# EAGLE design RELAISKARTE (EAGLE 4.16)
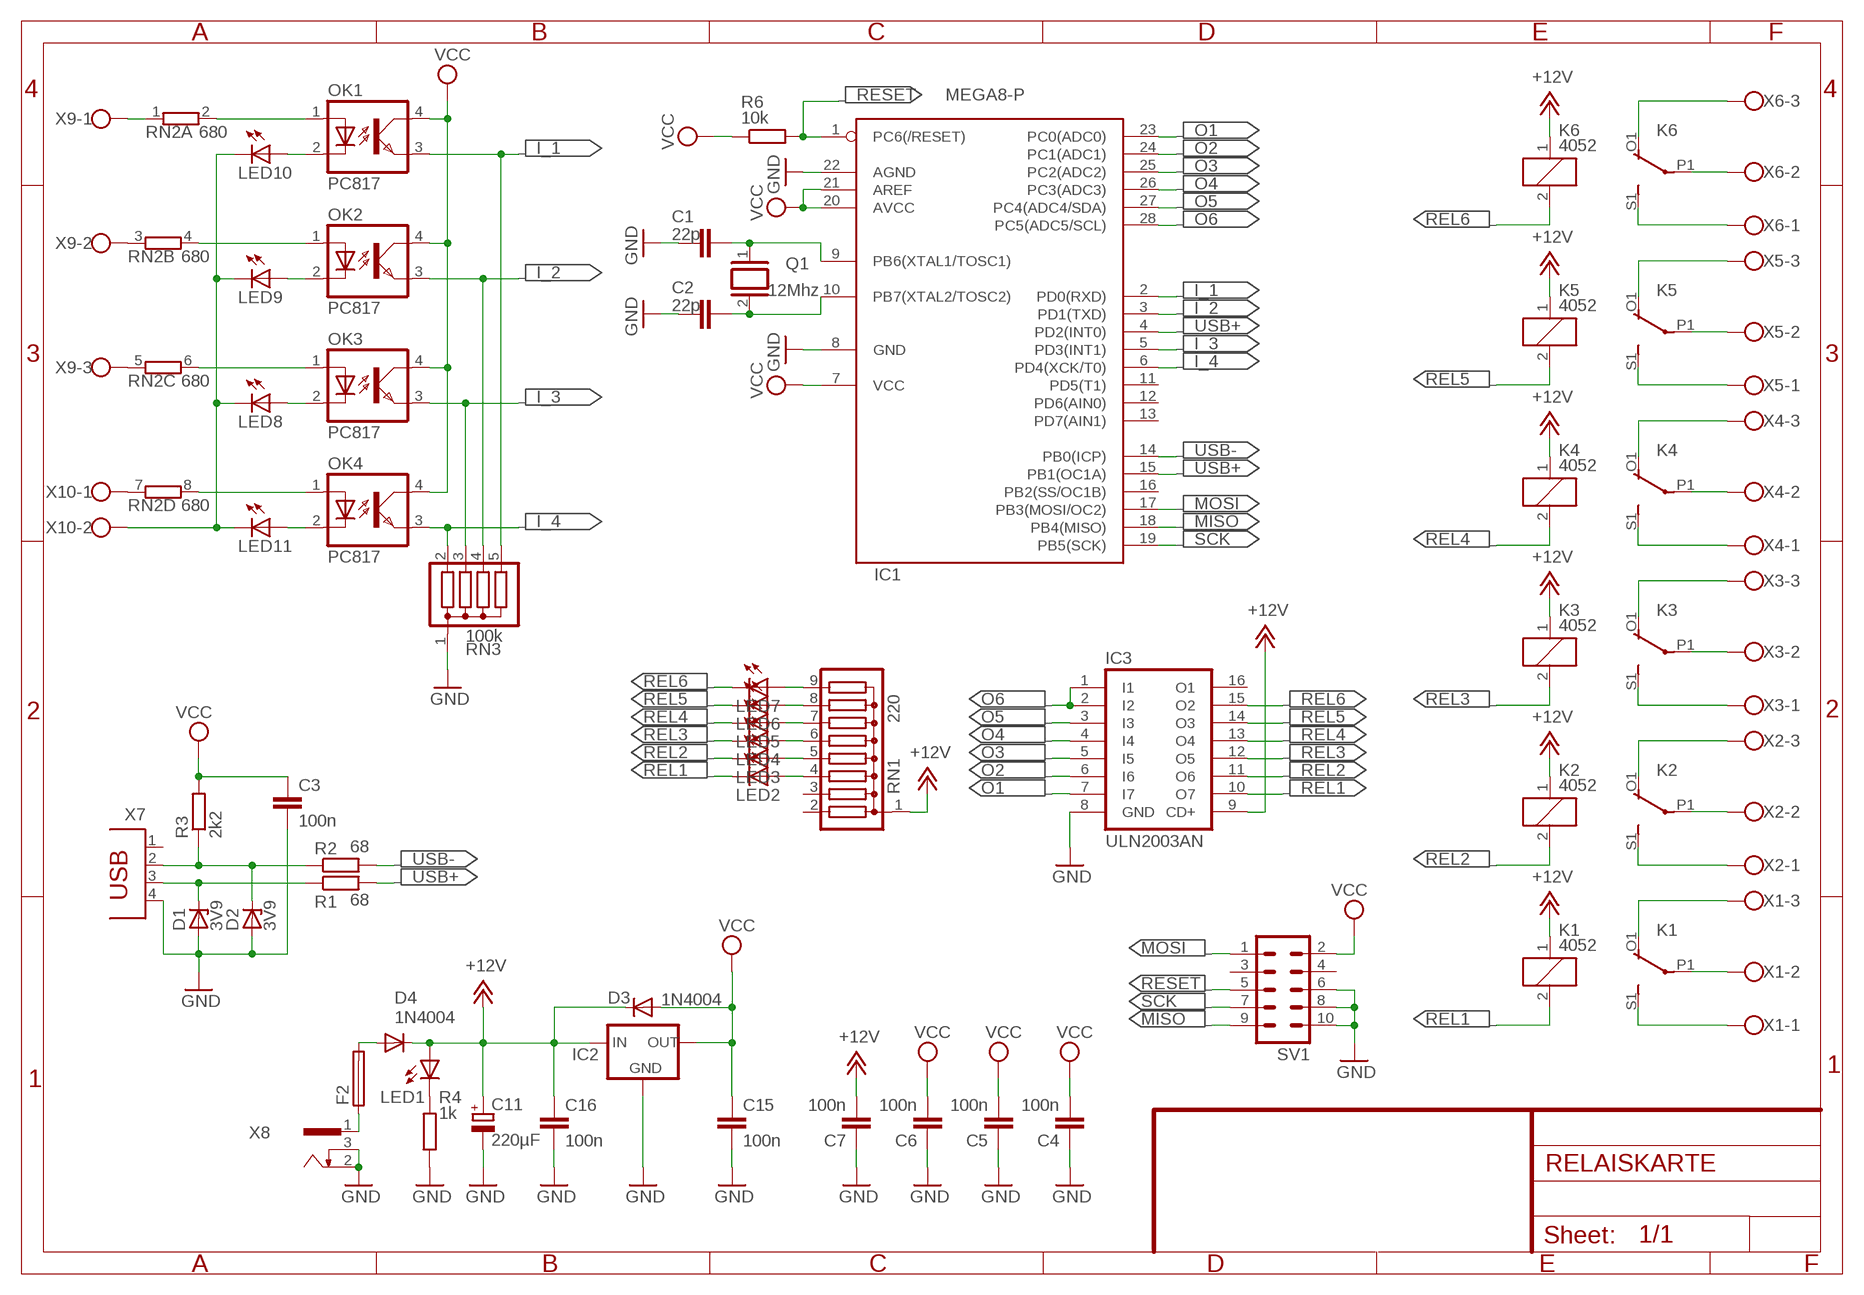
[diagram p0: schematic, sheet 1]

## Parts
C1  22p  C-EU025-024X044  [C025-024X044]
C2  22p  C-EU025-024X044  [C025-024X044]
C3  100n  C-EU050-024X044  [C050-024X044]
C4  100n  C-EU025-024X044  [C025-024X044]
C5  100n  C-EU025-024X044  [C025-024X044]
C6  100n  C-EU025-024X044  [C025-024X044]
C7  100n  C-EU025-024X044  [C025-024X044]
C11  220µF  CPOL-EUE3.5-8  [E3,5-8]
C15  100n  C-EU050-024X044  [C050-024X044]
C16  100n  C-EU050-024X044  [C050-024X044]
D1  3V9  BZX55  [DO35Z10]
D2  3V9  BZX55  [DO35Z10]
D3  1N4004  [DO41-10]
D4  1N4004  [DO41-10]
F2  PICOFUSE  [PICOFUSE]
IC1  MEGA8-P  [DIL28-3]
IC2  78XXS  [78XXS]
IC3  ULN2003AN  [DIL16]
K1  4052  [F4052]
K2  4052  [F4052]
K3  4052  [F4052]
K4  4052  [F4052]
K5  4052  [F4052]
K6  4052  [F4052]
LED1  LEDSQR2X5  [LED2X5]
LED2  LEDSQR2X5  [LED2X5]
LED3  LEDSQR2X5  [LED2X5]
LED4  LEDSQR2X5  [LED2X5]
LED5  LEDSQR2X5  [LED2X5]
LED6  LEDSQR2X5  [LED2X5]
LED7  LEDSQR2X5  [LED2X5]
LED8  LEDSQR2X5  [LED2X5]
LED9  LEDSQR2X5  [LED2X5]
LED10  LEDSQR2X5  [LED2X5]
LED11  LEDSQR2X5  [LED2X5]
OK1  PC817  [DIL04]
OK2  PC817  [DIL04]
OK3  PC817  [DIL04]
OK4  PC817  [DIL04]
Q1  12Mhz  XTAL/S  [QS]
R1  68  R-EU_0207/10  [0207/10]
R2  68  R-EU_0207/10  [0207/10]
R3  2k2  R-EU_0207/10  [0207/10]
R4  1k  R-EU_0207/10  [0207/10]
R6  10k  R-EU_0207/10  [0207/10]
RN1  220  G08R  [SIL9]
RN2  680  E4R  [SIL8]
RN3  100k  G04R  [SIL5]
SV1  ML10  [ML10]
X1  W237-103  [W237-103]
X2  W237-103  [W237-103]
X3  W237-103  [W237-103]
X4  W237-103  [W237-103]
X5  W237-103  [W237-103]
X6  W237-103  [W237-103]
X7  PN61729  [PN61729]
X8  SCD-014A  [SCD-014-A]
X9  W237-3E  [W237-3E]
X10  W237-02P  [W237-132]

## Nets
+12V: C7.2 C11.+ C16.1 D3.C D4.C IC2.IN IC3.9(CD+) K1.1 K2.1 K3.1 K4.1 K5.1 K6.1 LED1.A RN1.1
GND: C1.1 C2.1 C3.2 C4.1 C5.1 C6.1 C7.1 C11.- C15.2 C16.2 D1.A D2.A IC1.8(GND) IC1.22(AGND) IC2.GND IC3.8(GND) R4.1 RN3.1 SV1.6 SV1.8 SV1.10 X7.4 X8.2 X8.3
I_1: IC1.2(PD0(RXD)) OK1.3(EMIT) RN3.5
I_2: IC1.3(PD1(TXD)) OK2.3(EMIT) RN3.4
I_3: IC1.5(PD3(INT1)) OK3.3(EMIT) RN3.3
I_4: IC1.6(PD4(XCK/T0)) OK4.3(EMIT) RN3.2
MISO: IC1.18(PB4(MISO)) SV1.9
MOSI: IC1.17(PB3(MOSI/OC2)) SV1.1
N$1: C1.2 IC1.9(PB6(XTAL1/TOSC1)) Q1.1
N$2: K5.P1(2:P) X5.2
N$3: K6.P1(2:P) X6.2
N$4: C2.2 IC1.10(PB7(XTAL2/TOSC2)) Q1.2
N$5: D1.C R1.1 X7.3
N$6: D2.C R2.1 R3.1 X7.2
N$7: LED7.A RN1.9
N$8: LED1.K(C) R4.2
N$9: K1.S1(2:S) X1.1
N$10: K1.O1(2:O) X1.3
N$11: K2.S1(2:S) X2.1
N$12: K2.O1(2:O) X2.3
N$13: K3.S1(2:S) X3.1
N$14: K3.O1(2:O) X3.3
N$15: K4.S1(2:S) X4.1
N$16: K4.O1(2:O) X4.3
N$17: K5.S1(2:S) X5.1
N$18: K5.O1(2:O) X5.3
N$19: K6.S1(2:S) X6.1
N$20: K6.O1(2:O) X6.3
N$21: D4.A F2.2
N$22: F2.1 X8.1
N$25: K1.P1(2:P) X1.2
N$27: K2.P1(2:P) X2.2
N$28: K3.P1(2:P) X3.2
N$29: K4.P1(2:P) X4.2
N$31: OK1.1(A) RN2.2
N$32: OK2.1(A) RN2.4
N$34: LED6.A RN1.8
N$35: LED5.A RN1.7
N$36: LED4.A RN1.6
N$37: LED3.A RN1.5
N$38: LED2.A RN1.4
N$39: OK3.1(A) RN2.6
N$40: OK4.1(A) RN2.8
N$41: RN2.1 X9.1
N$42: RN2.3 X9.2
N$43: RN2.5 X9.3
N$44: RN2.7 X10.1
N$45: LED8.K(C) LED9.K(C) LED10.K(C) LED11.K(C) X10.2
N$46: LED10.A OK1.2(C)
N$47: LED9.A OK2.2(C)
N$48: LED8.A OK3.2(C)
N$49: LED11.A OK4.2(C)
O1: IC1.23(PC0(ADC0)) IC3.7(I7)
O2: IC1.24(PC1(ADC1)) IC3.6(I6)
O3: IC1.25(PC2(ADC2)) IC3.5(I5)
O4: IC1.26(PC3(ADC3)) IC3.4(I4)
O5: IC1.27(PC4(ADC4/SDA)) IC3.3(I3)
O6: IC1.28(PC5(ADC5/SCL)) IC3.1(I1) IC3.2(I2)
REL1: IC3.10(O7) K1.2 LED2.K(C)
REL2: IC3.11(O6) K2.2 LED3.K(C)
REL3: IC3.12(O5) K3.2 LED4.K(C)
REL4: IC3.13(O4) K4.2 LED5.K(C)
REL5: IC3.14(O3) K5.2 LED6.K(C)
REL6: IC3.15(O2) K6.2 LED7.K(C)
RESET: IC1.1(PC6(/RESET)) R6.2 SV1.5
SCK: IC1.19(PB5(SCK)) SV1.7
USB+: IC1.4(PD2(INT0)) IC1.15(PB1(OC1A)) R1.2
USB-: IC1.14(PB0(ICP)) R2.2
VCC: C3.1 C4.2 C5.2 C6.2 C15.1 D3.A IC1.7(VCC) IC1.20(AVCC) IC1.21(AREF) IC2.OUT OK1.4(COL) OK2.4(COL) OK3.4(COL) OK4.4(COL) R3.2 R6.1 SV1.2
Unconnected: IC1.11(PD5(T1)) IC1.12(PD6(AIN0)) IC1.13(PD7(AIN1)) IC1.16(PB2(SS/OC1B)) IC3.16(O1) K1.O2(3:O) K1.P2(3:P) K1.S2(3:S) K2.O2(3:O) K2.P2(3:P) K2.S2(3:S) K3.O2(3:O) K3.P2(3:P) K3.S2(3:S) K4.O2(3:O) K4.P2(3:P) K4.S2(3:S) K5.O2(3:O) K5.P2(3:P) K5.S2(3:S) K6.O2(3:O) K6.P2(3:P) K6.S2(3:S) RN1.2 RN1.3 SV1.3 SV1.4 X7.1

## Library data of the parts
C1-C7 C15 C16 = rcl:C-EU: CAPACITOR, European symbol
C11 = rcl:CPOL-EU: POLARIZED CAPACITOR, European symbol
D1 D2 = diode:BZX55: Z DIODE
D3 D4 = diode:1N4004: DIODE general purpose rectifier, 1 A
F2 = fuse:PICOFUSE: PICOFUSE 19275, Wickmann
IC1 = avr-1:MEGA8-P: MICROCONTROLLER 8 Kbytes FLASH 1 kbytes SRAM 512 bytes EEPROM USART 4-channel 10 bit ADC 2-channel 8 bit ADC
IC2 = v-reg:78XXS: VOLTAGE REGULATOR
IC3 = uln-udn:ULN2003A: DRIVER ARRAY
K1-K6 = relay:4052: RELAY 2 x switch, Finder
LED1-LED11 = led:LED: LED OSRAM: - CHIPLED LG R971, LG N971, LY N971, LG Q971, LY Q971, LO R971, LY R971 LH N974, LH R974 LS Q976, LO Q976, LY Q976 LO Q996 - Hyper CHIPLED LW Q18S LB Q993, LB Q99A, LB R99A - SideLED LS A670, LO A670, LY A670, LG A670, LP A670 LB A673, LV A673, LT A673, LW A673 LH A674 LY A675 LS A676, LA A676, LO A676, LY A676, LW A676 LS A679, LY A679, LG A679 - Hyper Micro SIDELED® LS Y876, LA Y876, LO Y876, LY Y876 LT Y87S - SmartLED LW L88C, LW L88S LB L89C, LB L89S, LG L890 LS L89K, LO L89K, LY L89K LS L896, LA L896, LO L896, LY L896 - TOPLED LS T670, LO T670, LY T670, LG T670, LP T670 LSG T670, LSP T670, LSY T670, LOP T670, LYG T670 LG T671, LOG T671, LSG T671 LB T673, LV T673, LT T673, LW T673 LH T674 LS T676, LA T676, LO T676, LY T676, LB T676, LH T676, LSB T676, LW T676 LB T67C, LV T67C, LT T67C, LS T67K, LO T67K, LY T67K, LW E67C LS E67B, LA E67B, LO E67B, LY E67B, LB E67C, LV E67C, LT E67C LW T67C LS T679, LY T679, LG T679 LS T770, LO T770, LY T770, LG T770, LP T770 LB T773, LV T773, LT T773, LW T773 LH T774 LS E675, LA E675, LY E675, LS T675 LS T776, LA T776, LO T776, LY T776, LB T776 LHGB T686 LT T68C, LB T68C - Hyper Mini TOPLED® LB M676 - Mini TOPLED Santana® LG M470 LS M47K, LO M47K, LY M47K Source: http://www.osram.convergy.de - LUMILED® LXK2-PW12-R00, LXK2-PW12-S00, LXK2-PW14-U00, LXK2-PW14-V00 LXK2-PM12-R00, LXK2-PM12-S00, LXK2-PM14-U00 LXK2-PE12-Q00, LXK2-PE12-R00, LXK2-PE12-S00, LXK2-PE14-T00, LXK2-PE14-U00 LXK2-PB12-K00, LXK2-PB12-L00, LXK2-PB12-M00, LXK2-PB14-N00, LXK2-PB14-P00, LXK2-PB14-Q00 LXK2-PR12-L00, LXK2-PR12-M00, LXK2-PR14-Q00, LXK2-PR14-R00 LXK2-PD12-Q00, LXK2-PD12-R00, LXK2-PD12-S00 LXK2-PH12-R00, LXK2-PH12-S00 LXK2-PL12-P00, LXK2-PL12-Q00, LXK2-PL12-R00 Source: www.luxeon.com
OK1-OK4 = optocoupler:PC817: SHARP OPTO COUPLER
Q1 = special:XTAL/S: CRYSTAL
R1-R4 R6 = rcl:R-EU_: RESISTOR, European symbol
RN1 = resistor-sil:G08R: SIL RESISTOR
RN2 = resistor-sil:E4R: SIL RESISTOR
RN3 = resistor-sil:G04R: SIL RESISTOR
SV1 = con-harting-ml:ML10: HARTING
X1-X6 = con-wago-500:W237-103: WAGO SCREW CLAMP
X7 = con-berg:PN61729: BERG USB connector
X8 = con-shiua-chyuan:SCD-014A: Power Jack 2.5mm
X9 = con-wago-508:W237-3E: WAGO SREW CLAMP
X10 = con-wago-508:W237-02P: WAGO SREW CLAMP

## Board
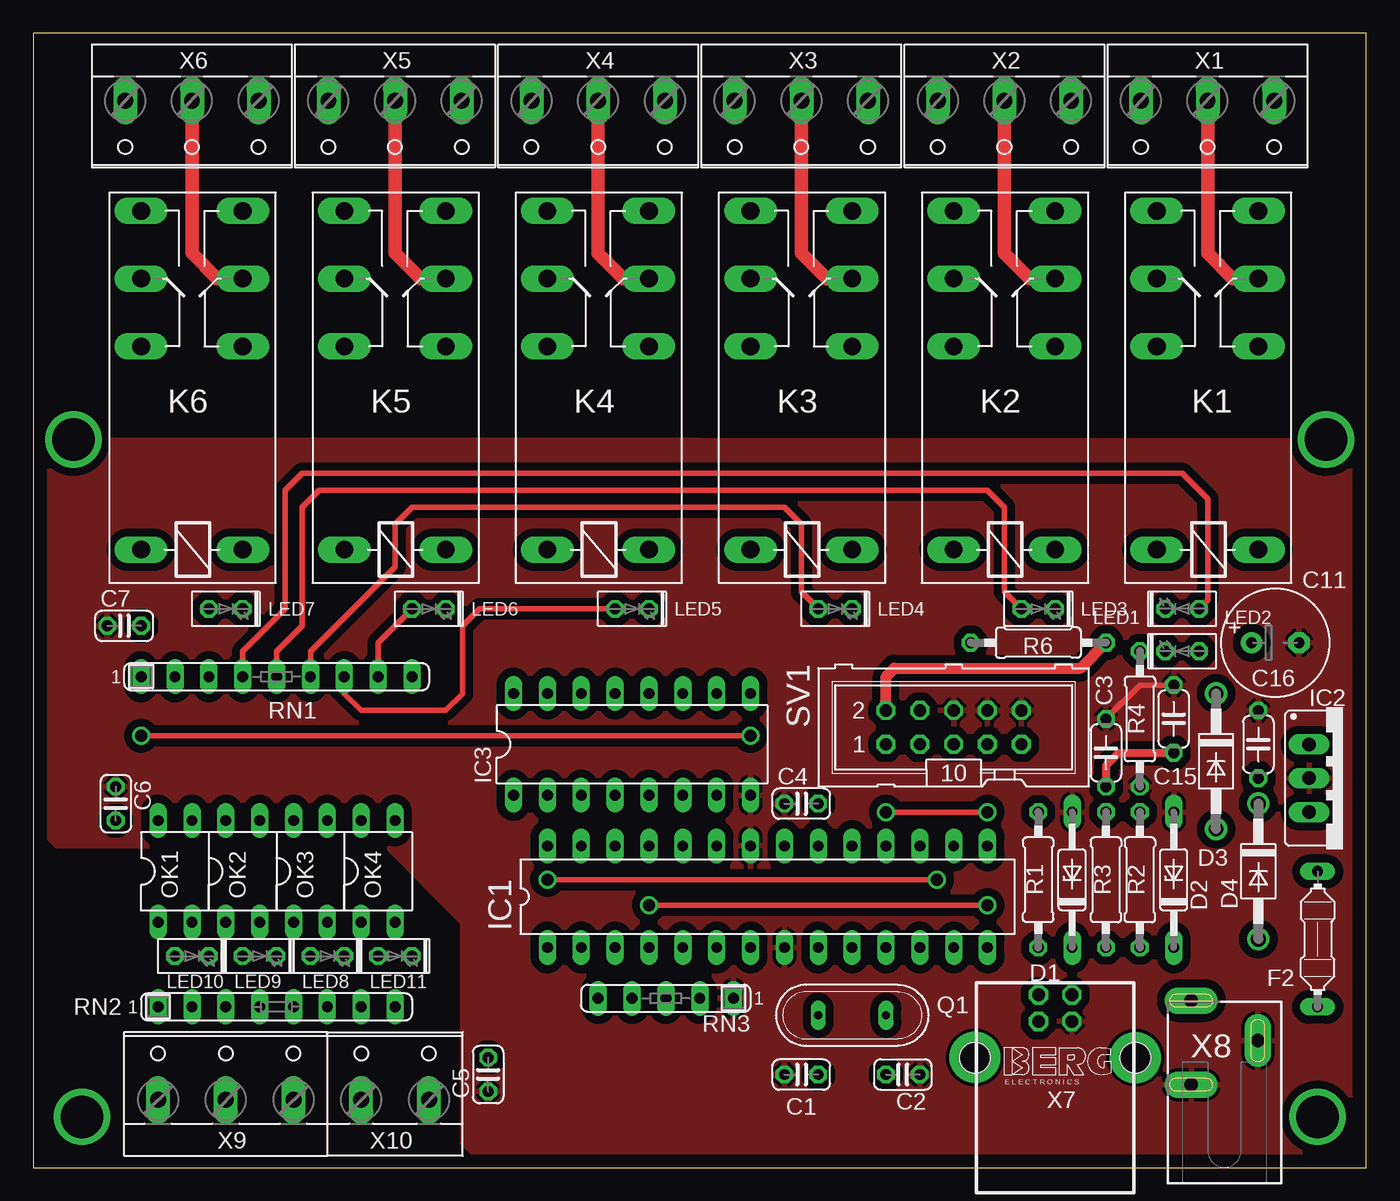
[diagram p1: board, top side]
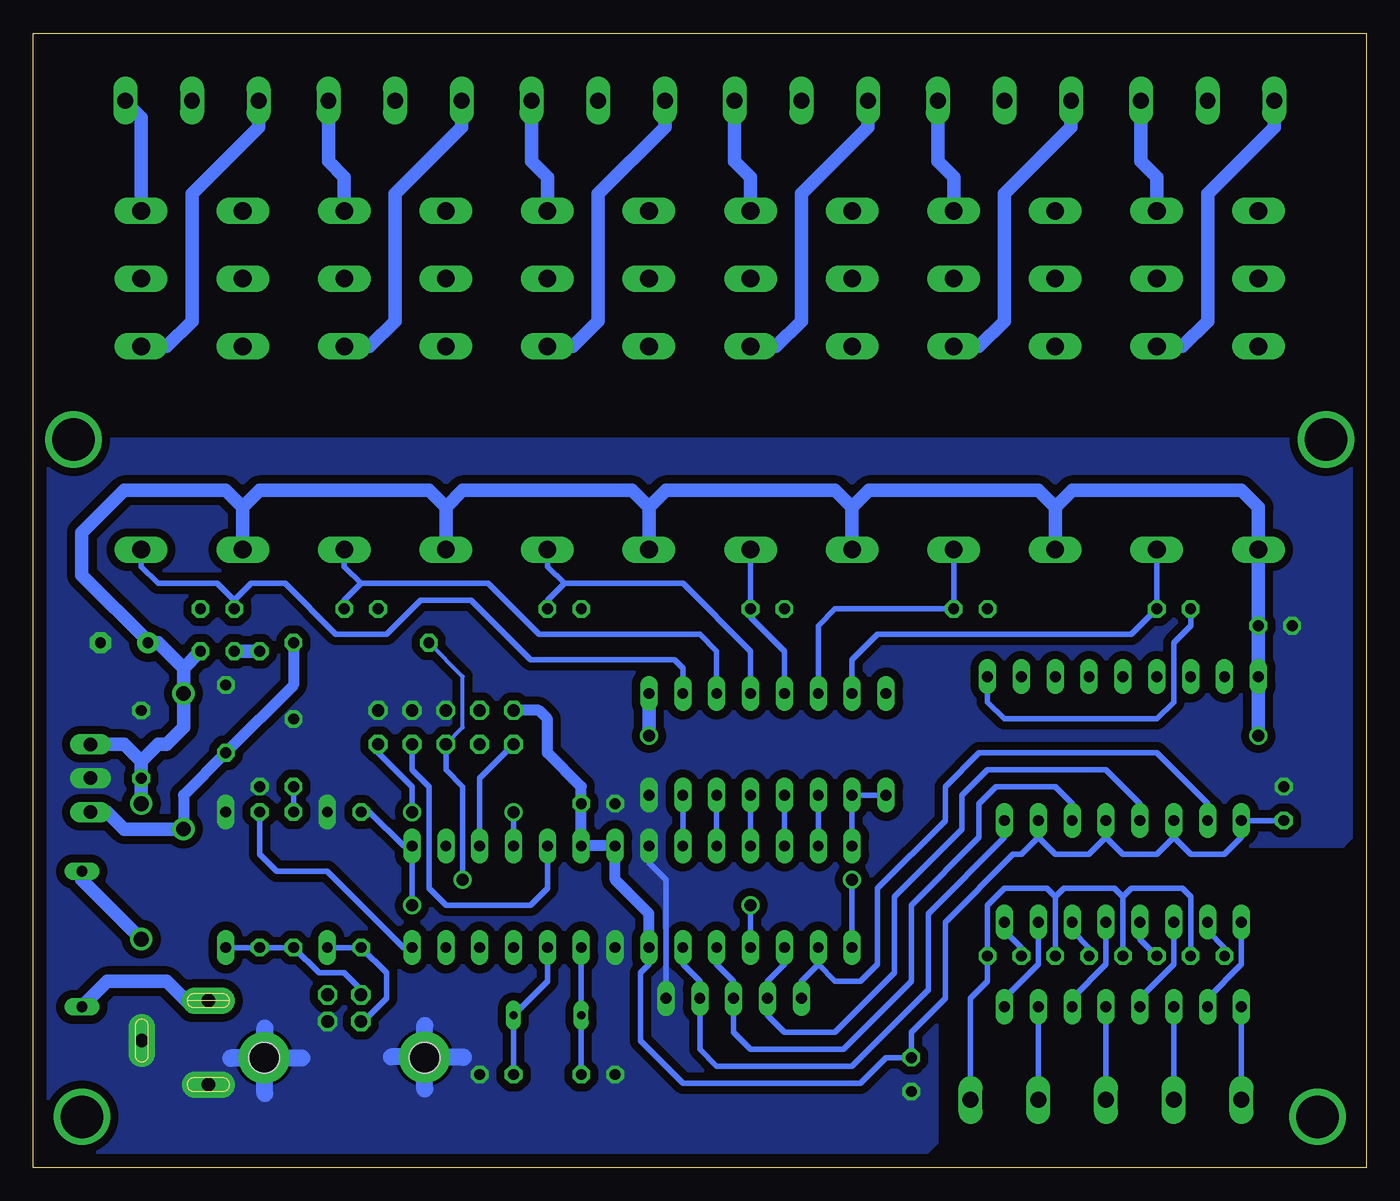
[diagram p2: board, bottom side, seen from below]

Size 100 x 85.07 mm. Coordinates in mm from the lower left corner, seen from the top.
Outline: 100,0 100,85.07 0,85.07 0,0 100,0
Copper layers (1*16): Top 0.035mm / dielectric 1.5mm / Bottom 0.035mm
Design rules "default": minimum track width 10mil, minimum drill 24mil, track to track 8mil, track to pad 8mil, pad to pad 8mil, via to via 8mil, smd to smd 8mil, copper to edge 40mil, drill to drill 8mil, minimum pad ring 10mil, minimum via ring 8mil, stop-mask expansion 4mil, vias tented up to drill 0mil, thermal gap 10mil

### Footprints (pad centres in the part's own frame; a part is rotated, then mirrored left to right if it is on the bottom)
C025-024X044 = drill 0.813 octagon: 1 -1.27,0; 2 1.27,0
C050-024X044 = drill 0.813 octagon: 1 -2.54,0; 2 2.54,0
E3,5-8 = drill 0.813 pad 1.6 round: + -1.778,0 | drill 0.813 pad 1.6 octagon: - 1.778,0
DO35Z10 = drill 0.813 long: A 5.08,0; C -5.08,0
DO41-10 = drill 1.118 round: A 5.08,0; C -5.08,0
PICOFUSE = drill 0.813 long: 1 -5.08,0; 2 5.08,0
DIL28-3 = drill 0.813 long: 1 -16.51,-3.81; 2 -13.97,-3.81; 3 -11.43,-3.81; 4 -8.89,-3.81; 5 -6.35,-3.81; 6 -3.81,-3.81; 7 -1.27,-3.81; 8 1.27,-3.81; 9 3.81,-3.81; 10 6.35,-3.81; 11 8.89,-3.81; 12 11.43,-3.81; 13 13.97,-3.81; 14 16.51,-3.81; 15 16.51,3.81; 16 13.97,3.81; 17 11.43,3.81; 18 8.89,3.81; 19 6.35,3.81; 20 3.81,3.81; 21 1.27,3.81; 22 -1.27,3.81; 23 -3.81,3.81; 24 -6.35,3.81; 25 -8.89,3.81; 26 -11.43,3.81; 27 -13.97,3.81; 28 -16.51,3.81
78XXS = drill 1.016 long: GND 0,-2.54; IN -2.54,-2.54; OUT 2.54,-2.54
DIL16 = drill 0.813 long: 1 -8.89,-3.81; 2 -6.35,-3.81; 3 -3.81,-3.81; 4 -1.27,-3.81; 5 1.27,-3.81; 6 3.81,-3.81; 7 6.35,-3.81; 8 8.89,-3.81; 9 8.89,3.81; 10 6.35,3.81; 11 3.81,3.81; 12 1.27,3.81; 13 -1.27,3.81; 14 -3.81,3.81; 15 -6.35,3.81; 16 -8.89,3.81
F4052 = drill 1.321 long: 1 -3.81,3.81; 2 -3.81,-3.81; O1 11.43,-3.81; O2 11.43,3.81; P1 16.51,-3.81; P2 16.51,3.81; S1 21.59,-3.81; S2 21.59,3.81
LED2X5 = drill 0.813 octagon: A -1.27,0; K 1.27,0
DIL04 = drill 0.813 long: 1 -1.27,-3.81; 2 1.27,-3.81; 3 1.27,3.81; 4 -1.27,3.81
QS = drill 0.61 long: 1 -2.54,0; 2 2.54,0
0207/10 = drill 0.813 octagon: 1 -5.08,0; 2 5.08,0
SIL9 = drill 0.813 long: 1 -10.16,0; 2 -7.62,0; 3 -5.08,0; 4 -2.54,0; 5 0,0; 6 2.54,0; 7 5.08,0; 8 7.62,0; 9 10.16,0
SIL8 = drill 0.813 long: 1 -8.89,0; 2 -6.35,0; 3 -3.81,0; 4 -1.27,0; 5 1.27,0; 6 3.81,0; 7 6.35,0; 8 8.89,0
SIL5 = drill 0.813 long: 1 -5.08,0; 2 -2.54,0; 3 0,0; 4 2.54,0; 5 5.08,0
ML10 = drill 0.914 octagon: 1 -5.08,-1.27; 2 -5.08,1.27; 3 -2.54,-1.27; 4 -2.54,1.27; 5 0,-1.27; 6 0,1.27; 7 2.54,-1.27; 8 2.54,1.27; 9 5.08,-1.27; 10 5.08,1.27
W237-103 = drill 1.194 long: 1 -5,-1.29; 2 0,-1.29; 3 5,-1.29
PN61729 = drill 0.95 octagon: 1 1.25,4.71; 2 -1.25,4.71; 3 -1.25,2.71; 4 1.25,2.71 | hole 2.3: -6.02,0; 6.02,0
SCD-014-A = drill 1 pad 2 long: 1 -2.5,13.8; 2 -2.5,7.5; 3 2.5,10.8
W237-3E = drill 1.194 long: 1 -5.08,-0.635; 2 0,-0.635; 3 5.08,-0.635
W237-132 = drill 1.194 long: 1 -2.54,-0.635; 2 2.54,-0.635

### Placement (x,y rotation side)
C1  57.62,6.98 0 top
C2  65.24,6.98 180 top
C3  80.48,31.11 90 top
C4  57.62,27.3 0 top
C5  34.12,6.98 90 top
C6  6.18,27.3 270 top
C7  6.82,40.63 0 top
C11  93.18,39.36 0 top
C15  85.56,33.65 90 top
C16  91.91,31.75 90 top
D1  77.94,21.59 90 top
D2  85.56,21.59 90 top
D3  88.73,30.48 270 top
D4  91.91,22.22 270 top
F2  96.35,17.14 90 top
IC1  55.08,20.32 0 top
IC2  98.26,29.21 270 top
IC3  44.92,31.75 0 top
K1  88.1,50.16 90 top
K2  72.86,50.16 90 top
K3  57.62,50.16 90 top
K4  42.38,50.16 90 top
K5  27.14,50.16 90 top
K6  11.9,50.16 90 top
LED1  86.19,38.73 180 top
LED2  86.19,41.9 180 top
LED3  75.4,41.9 0 top
LED4  60.16,41.9 0 top
LED5  44.92,41.9 0 top
LED6  29.68,41.9 0 top
LED7  14.44,41.9 0 top
LED8  22.06,15.87 0 top
LED9  16.98,15.87 0 top
LED10  11.9,15.87 0 top
LED11  27.14,15.87 0 top
OK1  10.63,22.22 0 top
OK2  15.71,22.22 0 top
OK3  20.79,22.22 0 top
OK4  25.87,22.22 0 top
Q1  61.43,11.42 0 top
R1  75.4,21.59 90 top
R2  83.02,21.59 90 top
R3  80.48,21.59 90 top
R4  83.02,33.65 90 top
R6  75.4,39.36 180 top
RN1  18.25,36.82 0 top
RN2  18.25,12.06 0 top
RN3  47.46,12.69 180 top
SV1  69.05,33.02 0 top
X1  88.1,78.73 180 top
X2  72.86,78.73 180 top
X3  57.62,78.73 180 top
X4  42.38,78.73 180 top
X5  27.14,78.73 180 top
X6  11.9,78.73 180 top
X7  76.67,8.25 0 top
X8  89.37,-1.27 0 top
X9  14.44,5.71 0 top
X10  27.14,5.71 0 top

### Tracks (layer width: path | path; a pad name or v marks a point on that pad's centre or on a via)
+12V  (via drill 0.9)
  Top 0.406: v8.09,32.38 v53.81,32.38
  Bottom 0.406: 91.27,39.36 C11.+
  Bottom 1.016: 84.29,49.52 83.02,50.79 70.32,50.79 69.05,49.52 | 69.05,49.52 K2.1 | 69.05,49.52 67.78,50.79 55.08,50.79 53.81,49.52 | 53.81,49.52 K3.1 | 53.81,49.52 52.54,50.79 39.84,50.79 38.57,49.52 | 38.57,49.52 K4.1 | 38.57,49.52 37.3,50.79 24.6,50.79 23.33,49.52 | 23.33,49.52 K5.1 | 23.33,49.52 22.06,50.79 9.36,50.79 8.09,49.52 K6.1 C7.2 RN1.1 v8.09,32.38 | v53.81,32.38 IC3.9 | 84.29,49.52 K1.1 | 84.29,49.52 85.56,50.79 93.18,50.79 96.35,47.62 96.35,44.45 91.27,39.36 90.64,39.36 88.73,37.46 | D4.C C16.1 91.91,30.48 | 91.91,30.48 93.18,31.75 IC2.IN | 91.91,30.48 90.64,31.75 90,31.75 88.73,33.02 D3.C 88.73,37.46 | 88.73,37.46 LED1.A
GND  (via drill 2.2 pad 3.81)
  Top 0.406: C15.2 83.02,36.19 C3.2
  Bottom 0.406: RN3.1 52.54,21.59 53.81,22.86 IC1.22
  Bottom 1.27: v70.65,8.27 67.76,8.27 67.76,8.31 70.64,8.31 | 70.64,8.31 73.15,8.31 | 70.64,8.31 70.64,10.64 | 70.64,5.89 70.64,8.31 | v82.68,8.23 85.17,8.23 85.17,8.2 85.14,8.23 82.63,8.23 | 82.63,8.23 79.86,8.23 | 82.63,8.23 82.63,10.47 82.63,10.46 82.63,5.57
  pour Bottom (isolate 0.61, no thermals): 0.47,25.39 0.47,54.6 99.53,54.6 99.53,0.63 33.49,0.63 32.22,1.9 32.22,18.41 26.51,24.12 1.74,24.12
  pour Top (isolate 0.61): 0.47,54.6 99.5,54.51 99.5,0.54 33.49,0.63 32.22,1.9 32.22,18.41 26.51,24.12 1.74,24.12 0.47,25.39
I_1
  Bottom 0.406: 41.11,15.23 42.38,13.96 RN3.5 | 41.11,15.23 IC1.2 | 41.11,15.23 39.84,13.96 37.94,13.96 36.66,15.23 36.66,20.95 31.59,26.03 31.59,28.57 29.05,31.11 15.71,31.11 11.9,27.3 OK1.3
I_2
  Bottom 0.406: IC1.3 43.65,15.23 44.92,13.96 RN3.4 44.92,11.42 43.65,10.15 39.84,10.15 35.4,14.6 35.4,20.32 30.32,25.39 30.32,27.94 28.41,29.84 19.52,29.84 16.98,27.3 OK2.3
I_3
  Bottom 0.406: IC1.5 48.73,15.23 47.46,13.96 | 47.46,13.96 RN3.3 | 47.46,13.96 47.46,10.15 46.19,8.88 39.2,8.88 34.12,13.96 34.12,19.68 29.05,24.76 29.05,27.3 27.78,28.57 23.33,28.57 22.06,27.3 OK3.3
I_4
  Bottom 0.406: IC1.6 51.27,15.23 50,13.96 RN3.2 50,8.88 48.73,7.62 38.57,7.62 32.86,13.33 32.86,19.05 27.14,24.76 OK4.3
MISO  (via drill 0.9)
  Top 0.406: v63.97,26.67 v71.59,26.67
  Bottom 0.406: IC1.18 v63.97,26.67 | v71.59,26.67 71.59,28.57 74.13,31.11 SV1.9
MOSI
  Bottom 0.406: IC1.17 66.51,29.21 SV1.1
N$1
  Bottom 0.406: IC1.9 Q1.1 C1.2
N$2
  Top 1.016: X5.2 27.14,68.58 29.05,66.67 K5.P1
N$3
  Top 1.016: X6.2 11.9,68.58 13.81,66.67 K6.P1
N$4
  Bottom 0.406: IC1.10 61.43,13.96 Q1.2 C2.2
N$5
  Bottom 0.406: X7.3 75.23,10.96 73.49,12.69 73.49,14.6 R1.1 D1.C
N$6
  Bottom 0.406: D2.C R2.1 R3.1 78.57,14.6 76.67,14.6 75.42,13.35 X7.2
N$7
  Bottom 0.406: RN1.9 28.41,34.92 27.14,33.65 15.71,33.65 14.44,34.92 14.44,39.36 13.17,40.63 LED7.A
N$8
  Bottom 1.016: R4.2 LED1.K
N$9
  Bottom 1.016: X1.1 93.1,79.93 91.91,78.73 K1.S1
N$10
  Bottom 1.016: X1.3 83.1,78.02 88.1,73.02 88.1,63.49 90,61.59 K1.O1
N$11
  Bottom 1.016: X2.1 77.86,75.48 76.67,74.29 K2.S1
N$12
  Bottom 1.016: X2.3 67.86,78.02 72.86,73.02 72.86,63.49 74.77,61.59 K2.O1
N$13
  Bottom 1.016: X3.1 62.62,75.48 61.43,74.29 K3.S1
N$14
  Bottom 1.016: X3.3 52.62,78.02 57.62,73.02 57.62,63.49 59.52,61.59 K3.O1
N$15
  Bottom 1.016: X4.1 47.38,75.48 46.19,74.29 K4.S1
N$16
  Bottom 1.016: X4.3 37.38,78.02 42.38,73.02 42.38,63.49 44.29,61.59 K4.O1
N$17
  Bottom 1.016: X5.1 32.14,75.48 30.95,74.29 K5.S1
N$18
  Bottom 1.016: X5.3 22.14,78.02 27.14,73.02 27.14,63.49 29.05,61.59 K5.O1
N$19
  Bottom 1.016: X6.1 16.9,75.48 15.71,74.29 K6.S1
N$20
  Bottom 1.016: X6.3 6.9,78.02 11.9,73.02 11.9,63.49 13.81,61.59 K6.O1
N$21
  Bottom 1.016: D4.A 96.35,21.59 F2.2
N$22
  Bottom 1.016: X8.1 87.33,12.06 88.1,12.06 90,13.96 94.45,13.96 F2.1
N$23  (via drill 3.2)
  other vias: 96.99,54.6
N$24  (via drill 3.2)
  other vias: 3.01,54.6
N$25
  Top 1.016: X1.2 88.1,68.58 90,66.67 K1.P1
N$26  (via drill 3.2)
  other vias: 3.65,3.81
N$27
  Top 1.016: X2.2 72.86,68.58 74.77,66.67 K2.P1
N$28
  Top 1.016: X3.2 57.62,68.58 59.52,66.67 K3.P1
N$29
  Top 1.016: X4.2 42.38,68.58 44.29,66.67 K4.P1
N$30  (via drill 3.2)
  other vias: 96.35,3.81
N$31
  Bottom 0.406: OK1.1 9.36,15.23 11.9,12.69 RN2.2
N$32
  Bottom 0.406: OK2.1 14.44,15.23 16.98,12.69 RN2.4
N$34
  Top 0.406: RN1.8 25.87,39.36 LED6.A
N$35
  Top 0.406: RN1.7 23.33,35.55 24.6,34.28 30.95,34.28 32.22,35.55 32.22,40.63 33.49,41.9 LED5.A
N$36
  Top 0.406: RN1.6 20.79,38.73 27.14,45.08 27.14,48.25 28.41,49.52 56.35,49.52 57.62,48.25 57.62,43.17 LED4.A
N$37
  Top 0.406: RN1.5 18.25,38.73 20.16,40.63 20.16,49.52 21.43,50.79 71.59,50.79 72.86,49.52 72.86,43.17 LED3.A
N$38
  Top 0.406: RN1.4 15.71,38.73 18.89,41.9 18.89,50.79 20.16,52.06 86.19,52.06 88.1,50.16 88.1,42.54 LED2.A
N$39
  Bottom 0.406: OK3.1 19.52,15.23 22.06,12.69 RN2.6
N$40
  Bottom 0.406: OK4.1 24.6,15.23 27.14,12.69 RN2.8
N$41
  Bottom 0.406: X9.1 RN2.1
N$42
  Bottom 0.406: X9.2 RN2.3
N$43
  Bottom 0.406: X9.3 RN2.5
N$44
  Bottom 0.406: X10.1 RN2.7
N$45
  Bottom 0.406: LED10.K 13.17,20.32 13.81,20.95 17.62,20.95 18.25,20.32 | 18.25,20.32 LED9.K | 18.25,20.32 18.89,20.95 22.7,20.95 23.33,20.32 | 23.33,20.32 LED8.K | 23.33,20.32 23.96,20.95 27.14,20.95 28.41,19.68 LED11.K 28.41,13.96 29.68,12.69 X10.2
N$46
  Bottom 0.406: LED10.A 10.63,16.51 11.9,17.78 OK1.2
N$47
  Bottom 0.406: LED9.A 16.98,17.14 OK2.2
N$48
  Bottom 0.406: LED8.A 20.79,16.51 22.06,17.78 OK3.2
N$49
  Bottom 0.406: LED11.A 25.87,16.51 27.14,17.78 OK4.2
O1
  Bottom 0.406: IC1.23 IC3.7
O2
  Bottom 0.406: IC1.24 IC3.6
O3
  Bottom 0.406: IC1.25 IC3.5
O4
  Bottom 0.406: IC1.26 IC3.4
O5
  Bottom 0.406: IC1.27 IC3.3
O6
  Bottom 0.406: IC1.28 IC3.2 IC3.1
REL1
  Bottom 0.406: IC3.10 51.27,37.46 51.91,38.09 62.7,38.09 67.14,42.54 70.95,42.54 73.49,40 77.3,40 81.11,43.81 83.65,43.81 84.92,42.54 | K1.2 91.91,45.08 90.64,43.81 86.19,43.81 84.92,42.54 | 84.92,42.54 LED2.K
REL2
  Bottom 0.406: IC3.11 48.73,38.73 50,40 62.06,40 65.88,43.81 75.4,43.81 | K2.2 76.67,45.08 75.4,43.81 | 75.4,43.81 76.67,42.54 LED3.K
REL3
  Bottom 0.406: IC3.12 46.19,38.73 51.27,43.81 60.16,43.81 | K3.2 61.43,45.08 60.16,43.81 | 60.16,43.81 61.43,42.54 LED4.K
REL4
  Bottom 0.406: IC3.13 43.65,38.73 46.19,41.27 LED5.K K4.2
REL5
  Bottom 0.406: IC3.14 41.11,40.63 39.84,41.9 LED6.K K5.2
REL6
  Bottom 0.406: IC3.15 38.57,38.09 36.66,40 17.62,40 LED7.K K6.2
RESET  (via drill 0.9)
  Top 0.406: v38.57,21.59 v67.78,21.59
  Bottom 0.305: SV1.5 67.78,33.02 67.78,36.82 R6.2
  Bottom 0.406: SV1.5 69.05,29.84 67.78,28.57 v67.78,21.59 | IC1.1 v38.57,21.59
SCK
  Bottom 0.406: SV1.7 71.59,29.84 70.32,28.57 70.32,20.95 69.05,19.68 62.7,19.68 61.43,20.95 IC1.19
USB+  (via drill 0.9)
  Top 0.406: v46.19,19.68 v71.59,19.68
  Bottom 0.406: IC1.4 v46.19,19.68 | v71.59,19.68 IC1.15 72.22,24.12 74.77,26.67 R1.2
USB-
  Bottom 0.406: IC1.14 72.22,16.51 77.94,22.22 81.75,22.22 83.02,23.49 R2.2
VCC
  Top 0.406: C15.1 85.52,31.08
  Top 0.61: C3.1 80.48,30.16 81.41,31.08 85.52,31.08
  Top 0.813: SV1.2 63.97,36.82 64.6,37.46 78.57,37.46 R6.1
  Bottom 0.406: 14.44,24.76 13.17,23.49 10.63,23.49 9.36,24.76 OK1.4 C6.2 | 14.44,24.76 OK2.4 | 14.44,24.76 15.71,23.49 18.25,23.49 19.52,24.76 | 19.52,24.76 OK3.4 | 19.52,24.76 20.79,23.49 23.33,23.49 24.6,24.76 | 24.6,24.76 OK4.4 | 24.6,24.76 25.87,23.49 26.51,23.49 31.59,18.41 31.59,12.69 34.12,10.15 C5.2 36.03,8.25 37.94,6.34 51.27,6.34 54.45,9.52 54.45,14.6 53.81,15.23 IC1.7 | C3.1 R3.2
  Bottom 0.813: SV1.2 62.06,34.28 61.43,33.65 61.43,31.11 58.89,28.57 C4.2 IC1.20 IC1.21 56.35,21.59 53.81,19.05 IC1.7 | R6.1 80.48,36.19 C15.1 88.73,27.94 D3.A
  Bottom 1.016: D3.A 93.18,25.39 94.45,26.67 IC2.OUT